# Altium schematic sheet Main.SchDoc
size 101 x 50 mm
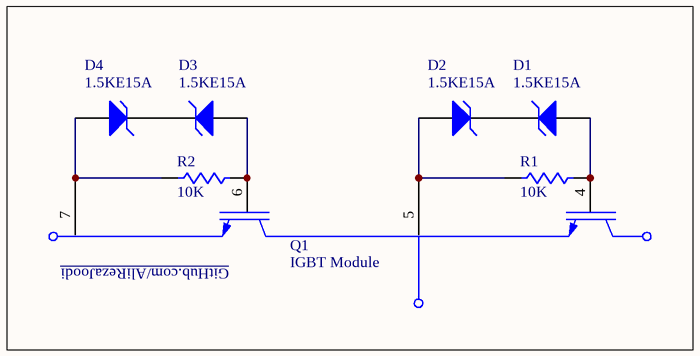
[diagram p0: Main.SchDoc]

## Parts
D1  1.5KE15A  [DIODE0.7V_number]
D2  1.5KE15A  [DIODE0.7V_number]
D3  1.5KE15A  [DIODE0.7V_N]
D4  1.5KE15A  [DIODE0.7V_N]
Q1  IGBT Module  [IGBT_Power]
R1  10K  [0805]
R2  10K  [0805]

## Nets
NetD1_1: D1.1(A) Q1.4(G) R1.2
NetD1_2: D1.2(K) D2.2(K)
NetD2_1: D2.1(A) Q1.5(S) R1.1
NetD3_1: D3.1(A) Q1.6(G) R2.2
NetD3_2: D3.2(K) D4.2(K)
NetD4_1: D4.1(A) Q1.7(S) R2.1

## Notes on the sheet
- (near Q1) GitHub.com/AliRezaJoodi

## Library data of the parts
D1-D4 = D Zener: Zener Diode; Manufacturer: Generic Components; Class I: Discrete; Class II: Diode - Zener; Published: 8-Jun-2000; Revision: July-2002: Re-released for DXP Platform.; Publisher: Altium Limited
Q1 = IGBT_Power: N-Channel MOSFET; Manufacturer: Generic Components; Class I: Discrete; Class II: MOSFET - Low Power; Published: 8-Jun-2000; Revision: July-2002: Re-released for DXP Platform.; Publisher: Altium Limited
R1 R2 = Res1: Resistor; Manufacturer: Generic Components; Class I: Passive; Published: 8-Jun-2000; Revision: July-2002: Re-released for DXP Platform.; Publisher: Altium Limited; Class II: Resistor